# Altium schematic sheet power.SchDoc
size A4
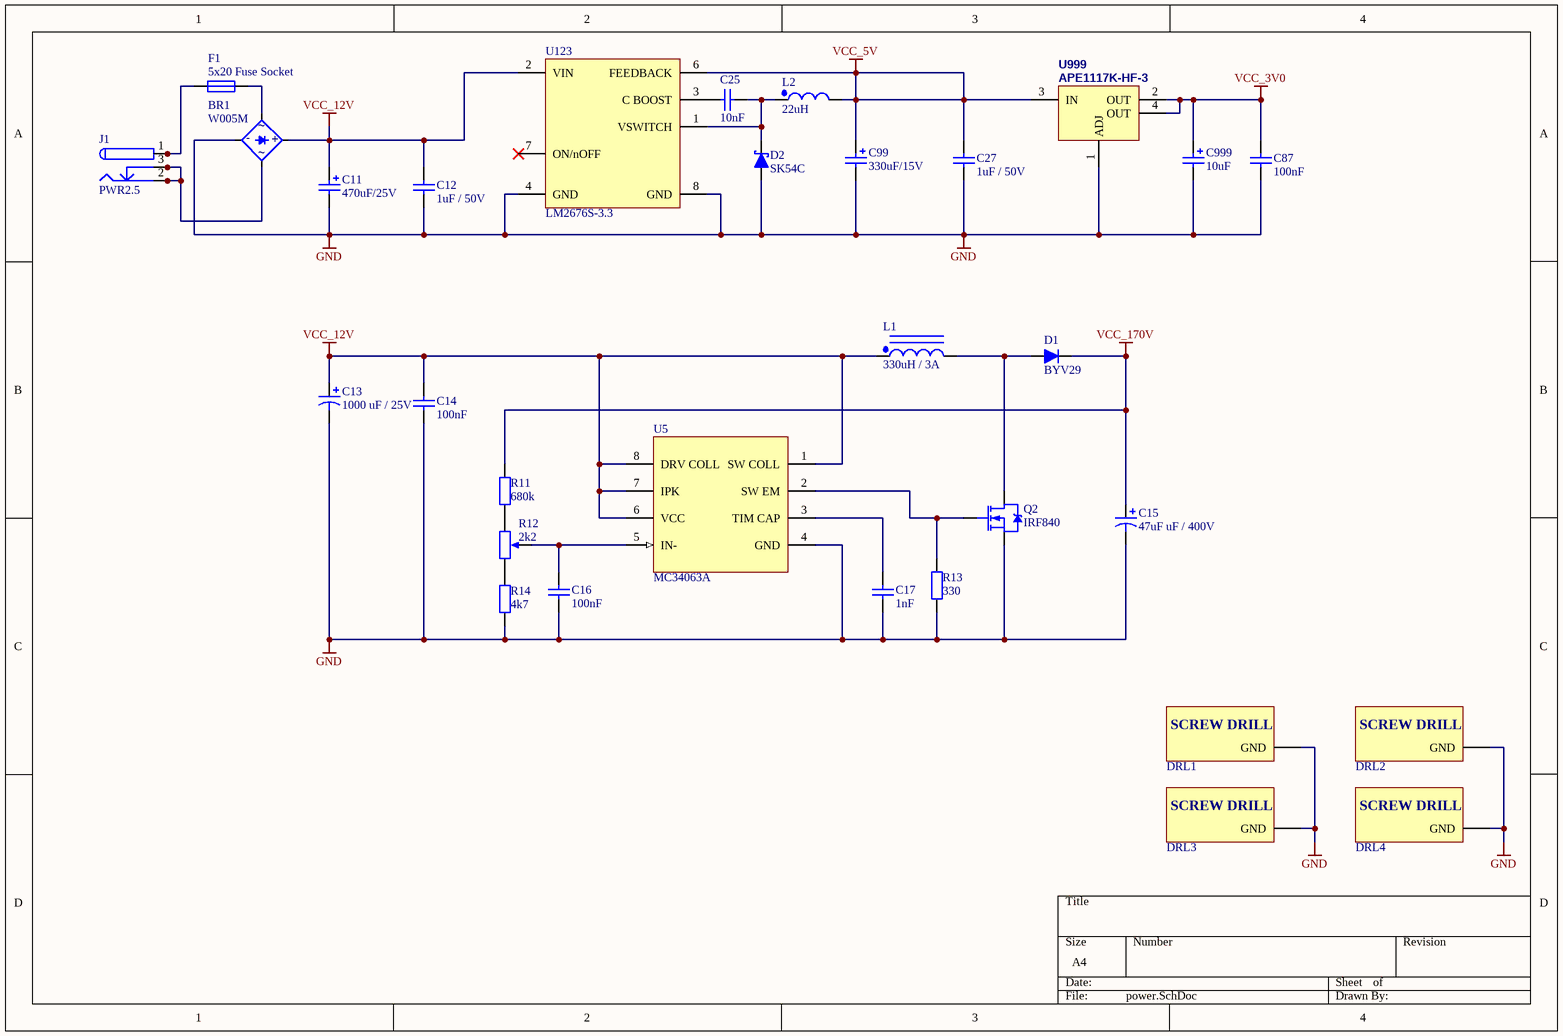
[diagram p0: power.SchDoc]

## Parts
BR1  W005M  [WxxM]
C11  470uF/25V  [SMDC]
C12  1uF / 50V  [C0805]
C13  1000 uF / 25V  [CE10x20-5_RA]
C14  100nF  [C0805]
C15  47uF uF / 400V  [CE10x20-5_RA]
C16  100nF  [C0805]
C17  1nF  [C0805]
C25  10nF  [C0805]
C27  1uF / 50V  [C0805]
C87  100nF  [C0805]
C99  330uF/15V  [SMDC]
C999  10uF  [SMDB]
D1  BYV29  [TO-220-2_RA]
D2  SK54C  [SMC]
DRL1  SCREW DRILL  [3mm screw drill I]  (value not drawn)
DRL2  SCREW DRILL  [3mm screw drill I]  (value not drawn)
DRL3  SCREW DRILL  [3mm screw drill I]  (value not drawn)
DRL4  SCREW DRILL  [3mm screw drill I]  (value not drawn)
F1  5x20 Fuse Socket  [Bezp 5x20 uniw II]
J1  PWR2.5  [KLD-0202]
L1  330uH / 3A  [IND_15_POZIOMO]
L2  22uH  [DE1207]
Q2  IRF840  [TO-220AB_RA_H1]
R11  680k  [R0805]
R12  2k2  [RPot_wieloob_19mm_lezacy]
R13  330  [R0805]
R14  4k7  [R0805]
U5  MC34063A  [SO8]
U123  LM2676S-3.3  [TO-263-7 (D2PAK-7)]
U999  APE1117K-HF-3  [SOT-223]

## Nets
GND: BR1.4(-) C11.2 C12.1 C13.2 C14.1 C15.2 C16.1 C17.1 C27.1 C87.1 C99.2 C999.2 D2.1(A) DRL1.0(GND) DRL2.0(GND) DRL3.0(GND) DRL4.0(GND) Q2.3(S) R13.1 R14.1 U5.4(GND) U123.4(GND) U123.8(GND) U999.1(ADJ)
VCC_3V0: C87.2 C999.1 U999.2(OUT) U999.4(OUT)
VCC_5V: C27.2 C99.1 L2.2 U123.6(FEEDBACK) U999.3(IN)
VCC_12V: BR1.1(+) C11.1 C12.2 C13.1 C14.2 L1.1 U5.1(SW_COLL) U5.6(VCC) U5.7(IPK) U5.8(DRV_COLL) U123.2(VIN)
VCC_170V: C15.1 D1.2(K) R11.2
NetBR1_2: BR1.2(AC) F1.2
NetBR1_3: BR1.3(AC) J1.2 J1.2A J1.2B J1.3 J1.3A J1.3B
NetC16_2: C16.2 R12.3(TAP) U5.5(IN-)
NetC17_2: C17.2 U5.3(TIM_CAP)
NetC25_1: C25.1 D2.2(K) L2.1 U123.1(VSWITCH)
NetC25_2: C25.2 U123.3(C_BOOST)
NetD1_1: D1.1(A) L1.2 Q2.2(D)
NetF1_1: F1.1 J1.1 J1.1A J1.1B
NetQ2_1: Q2.1(G) R13.2 U5.2(SW_EM)
NetR11_1: R11.1 R12.2(BOT)
NetR12_1: R12.1(TOP) R14.2

Not connected (* = marked no-connect by the designer): U123 5(NC) 7(ON/nOFF)*

## Notes on the sheet
- (in symbol W005M) ~

## Library data of the parts
BR1 = W005M: 50V, 1,5A, Single Phase Silicone Bridge Rectifier, DC Components; Published: 8-Jun-2000; LatestRevisionDate: 29-May-2009; LatestRevisionNote: Sch pins A & K swapped.; DatasheetVersion: E2732B; PackageReference: D-38; Publisher: Altium Limited; PackageDescription: Bridge Rectifier; 4 Terminals; Body 9.4 x 9.4 mm (typ); Pitch 5.08 mm
C11 C99 C999 = Cap Pol Tant: Polarized Tantalum Capacitor; ComponentLink1Description: datasheet; ComponentLink2Description: supplier
  C11: Value: 470uF/25V
  C99: Value: 330uF/15V
  C999: Value: 10uF
C12 C14 C16 C17 C25 C27 C87 = Cap: Capacitor; ComponentLink1Description: datasheet; ComponentLink2Description: supplier
  C12 C27: Value: 1uF / 50V
  C14 C16 C87: Value: 100nF
  C17: Value: 1nF
  C25: Value: 10nF
C13 C15 = Cap Pol: Polarized Capacitor; ComponentLink1Description: datasheet; ComponentLink2Description: supplier
  C13: Value: 1000 uF / 25V
  C15: Value: 47uF uF / 400V
D1 = BYV29: Rectifier diodes ultrafast; Published: 07-May-2007
D2 = SK54C: Schottky Diode: 40V, 5A; Published: 08-Mar-2006; PackageReference: SOT-23
F1 = Fuse Socket: Published: 8-Jun-2000; LatestRevisionDate: 17-Jul-2002; LatestRevisionNote: Re-released for DXP Platform.; PackageReference: PIN-W2/E2.8; Publisher: Altium Limited; PackageDescription: Thru-Hole; 2 Leads
J1 = PWR2.5: Low Voltage Power Supply Connector; Published: 17-Dec-2003; DatasheetDocument: 09-May-2002; Publisher: Altium Limited; ComponentLink1Description: Manufacturer Link; ComponentLink1URL: http://domino.kycon.com/internet/Products.html
L1 = InducCore: Magnetic-Core Inductor with Winding Polarity Marking; Published: 08-Mar-2006; Value: 330uH / 3A
L2 = Ind: Inductor; Published: 08-Mar-2006; ComponentLink1Description: datasheet; ComponentLink2Description: supplier; value: 22uH
Q2 = IRF840: N-Channel Power MOSFET; Published: 22-Jan-2007; Package Reference: TO-220
R11 R13 R14 = Res: Resistor; Published: 19-Feb-2006; ComponentLink1Description: datasheet; ComponentLink2Description: supplier
  R11: Value: 680k
  R13: Value: 330
  R14: Value: 4k7
R12 = RPot: Potentiometer; Published: 03-Apr-2006; Value: 2k2
U5 = MC34063A: 1.5 A, Step-Up/Down/Inverting Switching Regulator; Published: 22-Nov-2006; PackageReference: SO8
U123 = LM2676S-3.3: High Efficiency 3A Step-Down Simple Switcher 3.3V Regulator in TO-263 (D2PAK)
U999 = APE1117K-HF-3: 800mA Low-Dropout Adjustable, 1A Linear Regulator, SOT223 Package; Published: 24-Aug-2001; LatestRevisionDate: 06-Jun-2005; LatestRevisionNote: PCB Pin sequence re-ordered.; DatasheetVersion: Feb-2004; PackageVersion: Jul-2004; PackageReference: TO-220A; Publisher: Altium Limited; PackageDescription: TO, Thru-Hole, Vertical, Heatsink Mounted; 3 In-Line Leads; Pitch 2.54 mm; ComponentLink1Description: Manufacturer Link; ComponentLink1URL: http://www.st.com/; ComponentLink2Description: Datasheet; ComponentLink2URL: http://www.st.com/stonline/books/pdf/docs/2574.pdf; Supplier 1: TME; Supplier Part Number 1: APE1117K-HF-3